# Altium schematic sheet Sheet1-driver.SchDoc
size A4; SheetNumber: 2; SheetTotal: 4
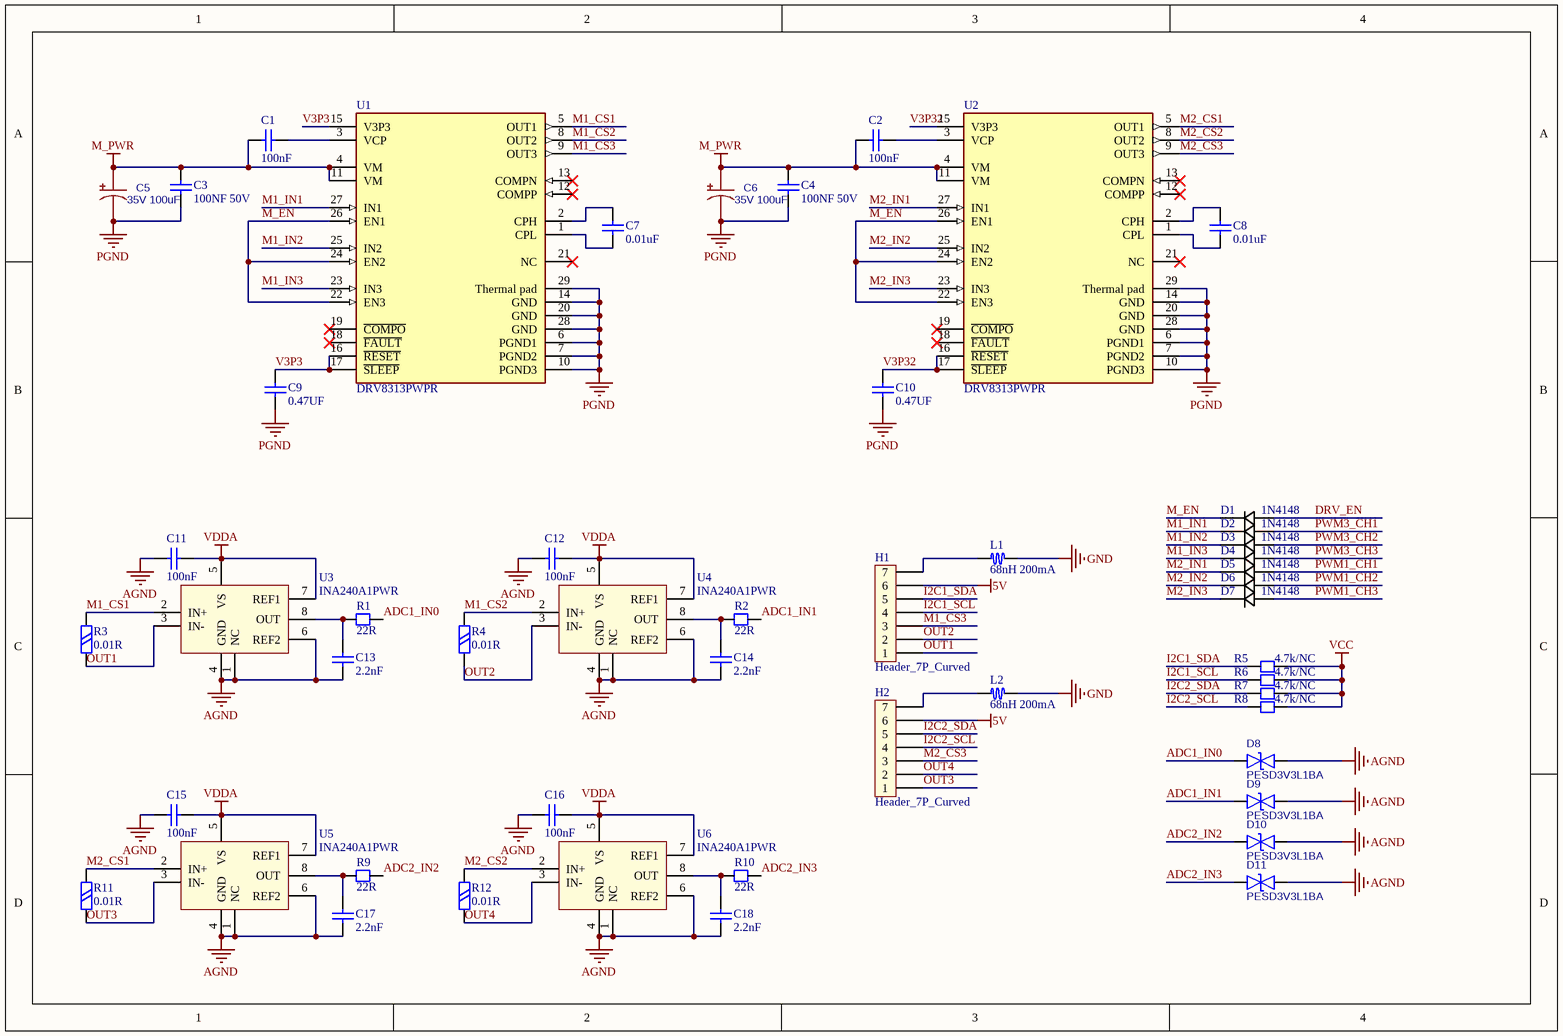
[diagram p0: Sheet1-driver.SchDoc]

## Parts
C1  100nF  [CC1608-0603]
C2  100nF  [CC1608-0603]
C3  100NF 50V  [CC1608-0603]
C4  100NF 50V  [CC1608-0603]
C5  35V 100uF  [CAP-SMD_D6.3]
C6  35V 100uF  [CAP-SMD_D6.3]
C7  0.01uF  [CC1608-0603]
C8  0.01uF  [CC1608-0603]
C9  0.47UF  [CC1608-0603]
C10  0.47UF  [CC1608-0603]
C11  100nF  [CC1608-0603]
C12  100nF  [CC1608-0603]
C13  2.2nF  [CC1608-0603]
C14  2.2nF  [CC1608-0603]
C15  100nF  [CC1608-0603]
C16  100nF  [CC1608-0603]
C17  2.2nF  [CC1608-0603]
C18  2.2nF  [CC1608-0603]
D1  1N4148  [SOD-323]
D2  1N4148  [SOD-323]
D3  1N4148  [SOD-323]
D4  1N4148  [SOD-323]
D5  1N4148  [SOD-323]
D6  1N4148  [SOD-323]
D7  1N4148  [SOD-323]
D8  PESD3V3L1BA  [SOD-323]
D9  PESD3V3L1BA  [SOD-323]
D10  PESD3V3L1BA  [SOD-323]
D11  PESD3V3L1BA  [SOD-323]
H1  Header_7P_Curved  [Header_2_54_7PW]
H2  Header_7P_Curved  [Header_2_54_7PW]
L1  68nH 200mA  [Inductor-0603]
L2  68nH 200mA  [Inductor-0603]
R1  22R  [CR1608-0603]
R2  22R  [CR1608-0603]
R3  0.01R  [CR3216-1206]
R4  0.01R  [CR3216-1206]
R5  4.7k/NC  [CR1608-0603]
R6  4.7k/NC  [CR1608-0603]
R7  4.7k/NC  [CR1608-0603]
R8  4.7k/NC  [CR1608-0603]
R9  22R  [CR1608-0603]
R10  22R  [CR1608-0603]
R11  0.01R  [CR3216-1206]
R12  0.01R  [CR3216-1206]
U1  DRV8313PWPR  [HTSSOP-28]
U2  DRV8313PWPR  [HTSSOP-28]
U3  INA240A1PWR  [TSSOP-8]
U4  INA240A1PWR  [TSSOP-8]
U5  INA240A1PWR  [TSSOP-8]
U6  INA240A1PWR  [TSSOP-8]

## Nets
5V: H1.6 H2.6
AGND: C11.2 C12.2 C13.1 C14.1 C15.2 C16.2 C17.1 C18.1 D8.2 D9.2 D10.2 D11.2 U3.1(NC) U3.4(GND) U3.6(REF2) U4.1(NC) U4.4(GND) U4.6(REF2) U5.1(NC) U5.4(GND) U5.6(REF2) U6.1(NC) U6.4(GND) U6.6(REF2)
GND: L1.2 L2.2
M_PWR: C1.2 C2.2 C3.1 C4.1 C5.1 C6.1 U1.4(VM) U1.11(VM) U2.4(VM) U2.11(VM)
PGND: C3.2 C4.2 C5.2 C6.2 C9.2 C10.2 U1.6(PGND1) U1.7(PGND2) U1.10(PGND3) U1.14(GND) U1.20(GND) U1.28(GND) U1.29(Thermal_pad) U2.6(PGND1) U2.7(PGND2) U2.10(PGND3) U2.14(GND) U2.20(GND) U2.28(GND) U2.29(Thermal_pad)
VCC: R5.2 R6.2 R7.2 R8.2
VDDA: C11.1 C12.1 C15.1 C16.1 U3.5(VS) U3.7(REF1) U4.5(VS) U4.7(REF1) U5.5(VS) U5.7(REF1) U6.5(VS) U6.7(REF1)
ADC1_IN0: D8.1 R1.1
ADC1_IN1: D9.1 R2.1
ADC2_IN2: D10.1 R9.1
ADC2_IN3: D11.1 R10.1
DRV_EN: D1.2
I2C1_SCL: H1.4 R6.1
I2C1_SDA: H1.5 R5.1
I2C2_SCL: H2.4 R8.1
I2C2_SDA: H2.5 R7.1
M1_CS1: R3.2 U1.5(OUT1) U3.2(IN+)
M1_CS2: R4.2 U1.8(OUT2) U4.2(IN+)
M1_CS3: H1.3 U1.9(OUT3)
M1_IN1: D2.1 U1.27(IN1)
M1_IN2: D3.1 U1.25(IN2)
M1_IN3: D4.1 U1.23(IN3)
M2_CS1: R11.2 U2.5(OUT1) U5.2(IN+)
M2_CS2: R12.2 U2.8(OUT2) U6.2(IN+)
M2_CS3: H2.3 U2.9(OUT3)
M2_IN1: D5.1 U2.27(IN1)
M2_IN2: D6.1 U2.25(IN2)
M2_IN3: D7.1 U2.23(IN3)
M_EN: D1.1 U1.22(EN3) U1.24(EN2) U1.26(EN1) U2.22(EN3) U2.24(EN2) U2.26(EN1)
OUT1: H1.1 R3.1 U3.3(IN-)
OUT2: H1.2 R4.1 U4.3(IN-)
OUT3: H2.1 R11.1 U5.3(IN-)
OUT4: H2.2 R12.1 U6.3(IN-)
PWM1_CH1: D5.2
PWM1_CH2: D6.2
PWM1_CH3: D7.2
PWM3_CH1: D2.2
PWM3_CH2: D3.2
PWM3_CH3: D4.2
V3P3: C9.1 U1.15(V3P3) U1.16(~{RESET}) U1.17(~{SLEEP})
V3P32: C10.1 U2.15(V3P3) U2.16(~{RESET}) U2.17(~{SLEEP})
NetC1_1: C1.1 U1.3(VCP)
NetC2_1: C2.1 U2.3(VCP)
NetC7_1: C7.1 U1.2(CPH)
NetC7_2: C7.2 U1.1(CPL)
NetC8_1: C8.1 U2.2(CPH)
NetC8_2: C8.2 U2.1(CPL)
NetC13_2: C13.2 R1.2 U3.8(OUT)
NetC14_2: C14.2 R2.2 U4.8(OUT)
NetC17_2: C17.2 R9.2 U5.8(OUT)
NetC18_2: C18.2 R10.2 U6.8(OUT)
NetH1_7: H1.7 L1.1
NetH2_7: H2.7 L2.1

Not connected (* = marked no-connect by the designer): U1 12(COMPP)* 13(COMPN)* 18(~{FAULT})* 19(~{COMPO})* 21(NC)*; U2 12(COMPP)* 13(COMPN)* 18(~{FAULT})* 19(~{COMPO})* 21(NC)*

## Library data of the parts
C1-C4 C7-C18 = Cap Chip 0603: 0603封装的电容; Published: 8-Jun-2000; Revision: July-2002: Re-released for DXP Platform.; Publisher: Altium Limited
C5 C6 = Cap ECAP SMD: 铝点解电容; BOM_Manufacturer: PANASONIC; BOM_Manufacturer Part: EEEFP1C681AP; nameAlias: Capacitance; Contributor: LCSC; BOM_Supplier: LCSC; BOM_Supplier Part: C413527; spicePre: C; spiceSymbolName: EEEFP1C681AP
D1-D7 = 1N4148: 1N5819 SOD-323封装 小体积SS14 印S4 肖特基二极管
D8-D11 = PESD3V3L1BA: SOD-323 3.3V 双向ESD防静电二极管保护芯片; Manufacturer: MDD; Manufacturer Part: SMAJ6.5CA; Supplier: LCSC; Supplier Part: C110041; JLCPCB Part Class: Extended Part; spicePre: D; spiceSymbolName: SMAJ6.5CA-C110041
H1 H2 = Header_7P_Curved: 弯的6P排针
L1 L2 = Inductor-0603: 贴片电感 0603封装
R1 R2 R5-R10 = Resistor Chip 0603: 0603封装电阻; Published: 8-Jun-2000; Revision: July-2002: Re-released for DXP Platform.; Publisher: Altium Limited
R3 R4 R11 R12 = Resistor Chip 1206: 1206封装电阻; Published: 8-Jun-2000; Revision: July-2002: Re-released for DXP Platform.; Publisher: Altium Limited
U1 U2 = DRV8313: 独立控制的半 H 桥驱动器,主要用于驱动一个三项无刷电机IC MOTOR DRIVER 8V-60V 28HTSSOP; Min Supply Voltage: 8V; Max Supply Voltage: 60V; Number of Outputs: 1; Output Current: 1.75A; Interface: Parallel; Logic Function: AND GATE; Min Operating Temperature: -40°C; Max Operating Temperature: 125°C; Mount: Surface Mount; Lead Free: Lead Free; Package Quantity: 2000; Number of Pins: 28; Case/Package: HTSSOP; Series: -; Packaging: Tape and Reel
U3-U6 = INA240A1PWR: 超精密电流检测放大器